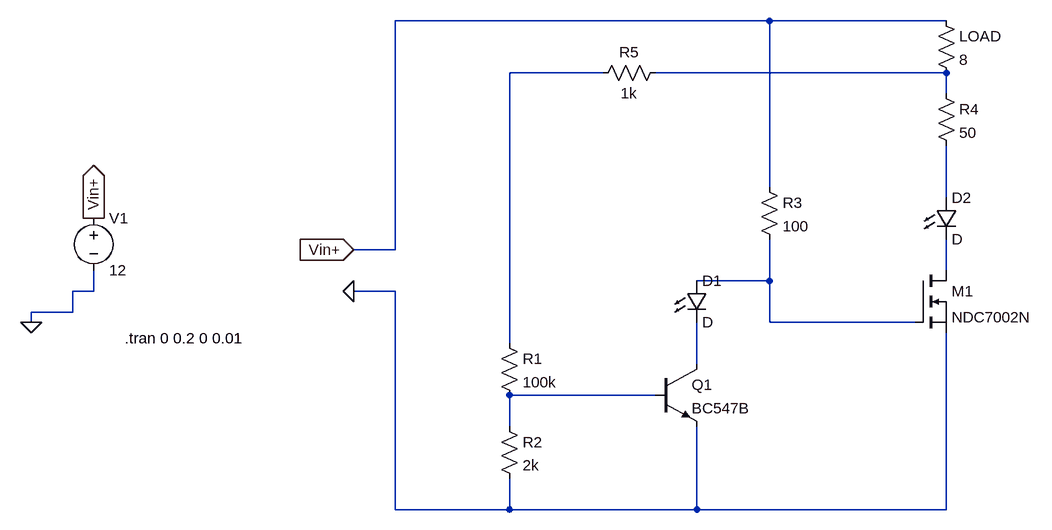
[diagram p0: schematic status leds.asc]
status leds.asc, the LTspice schematic file:
Version 4
SHEET 1 3028 680
WIRE 208 -416 -368 -416
WIRE 480 -416 208 -416
WIRE -48 -336 -192 -336
WIRE 480 -336 32 -336
WIRE 480 -304 480 -336
WIRE 208 -160 208 -416
WIRE 480 -144 480 -224
WIRE -368 -64 -368 -416
WIRE -368 -64 -432 -64
WIRE 480 -32 480 -80
WIRE 208 -16 208 -80
WIRE 208 -16 96 -16
WIRE -832 0 -832 -32
WIRE -832 0 -864 0
WIRE -368 0 -432 0
WIRE -864 32 -864 0
WIRE -864 32 -928 32
WIRE -928 48 -928 32
WIRE 208 48 208 -16
WIRE 432 48 208 48
WIRE -192 80 -192 -336
WIRE 96 112 96 48
WIRE 32 160 -192 160
WIRE -192 208 -192 160
WIRE -368 336 -368 0
WIRE -192 336 -192 288
WIRE -192 336 -368 336
WIRE 96 336 96 208
WIRE 96 336 -192 336
WIRE 480 336 480 64
WIRE 480 336 96 336
FLAG -432 -64 Vin+
IOPIN -432 -64 In
FLAG -832 -112 Vin+
IOPIN -832 -112 Out
FLAG -432 0 0
FLAG -928 48 0
SYMBOL res -208 64 R0
SYMATTR InstName R1
SYMATTR Value 100k
SYMBOL res -208 192 R0
SYMATTR InstName R2
SYMATTR Value 2k
SYMBOL LED 464 -144 R0
SYMATTR InstName D2
SYMBOL LED 80 -16 R0
SYMATTR InstName D1
SYMBOL res 192 -176 R0
SYMATTR InstName R3
SYMATTR Value 100
SYMBOL res 464 -320 R0
SYMATTR InstName R4
SYMATTR Value 50
SYMBOL res 48 -352 R90
WINDOW 0 0 56 VBottom 2
WINDOW 3 32 56 VTop 2
SYMATTR InstName R5
SYMATTR Value 1k
SYMBOL voltage -832 -128 R0
WINDOW 123 24 44 Left 2
WINDOW 39 0 0 Left 0
SYMATTR InstName V1
SYMATTR Value 12
SYMBOL res 464 -432 R0
SYMATTR InstName LOAD
SYMATTR Value 8
SYMBOL nmos 432 -32 R0
SYMATTR InstName M1
SYMATTR Value NDC7002N
SYMBOL npn 32 112 R0
SYMATTR InstName Q1
SYMATTR Value BC547B
TEXT -784 72 Left 2 !.tran 0 0.2 0 0.01

The netlist it stands for:
* status leds.asc
R1 N001 N007 100k
R2 N007 0 2k
D2 N003 N004 D
D1 N005 N006 D
R3 Vin+ N005 100
R4 N002 N003 50
R5 N002 N001 1k
V1 Vin+ 0 12
R§LOAD Vin+ N002 8
M1 N004 N005 0 0 NDC7002N
Q1 N006 N007 0 0 BC547B
.model D D
.lib standard.dio
.model NPN NPN
.model PNP PNP
.lib standard.bjt
.model NMOS NMOS
.model PMOS PMOS
.lib standard.mos
.tran 0 0.2 0 0.01
.backanno
.end